# EAGLE design relay-monostable-multivib (EAGLE 9.6.2)
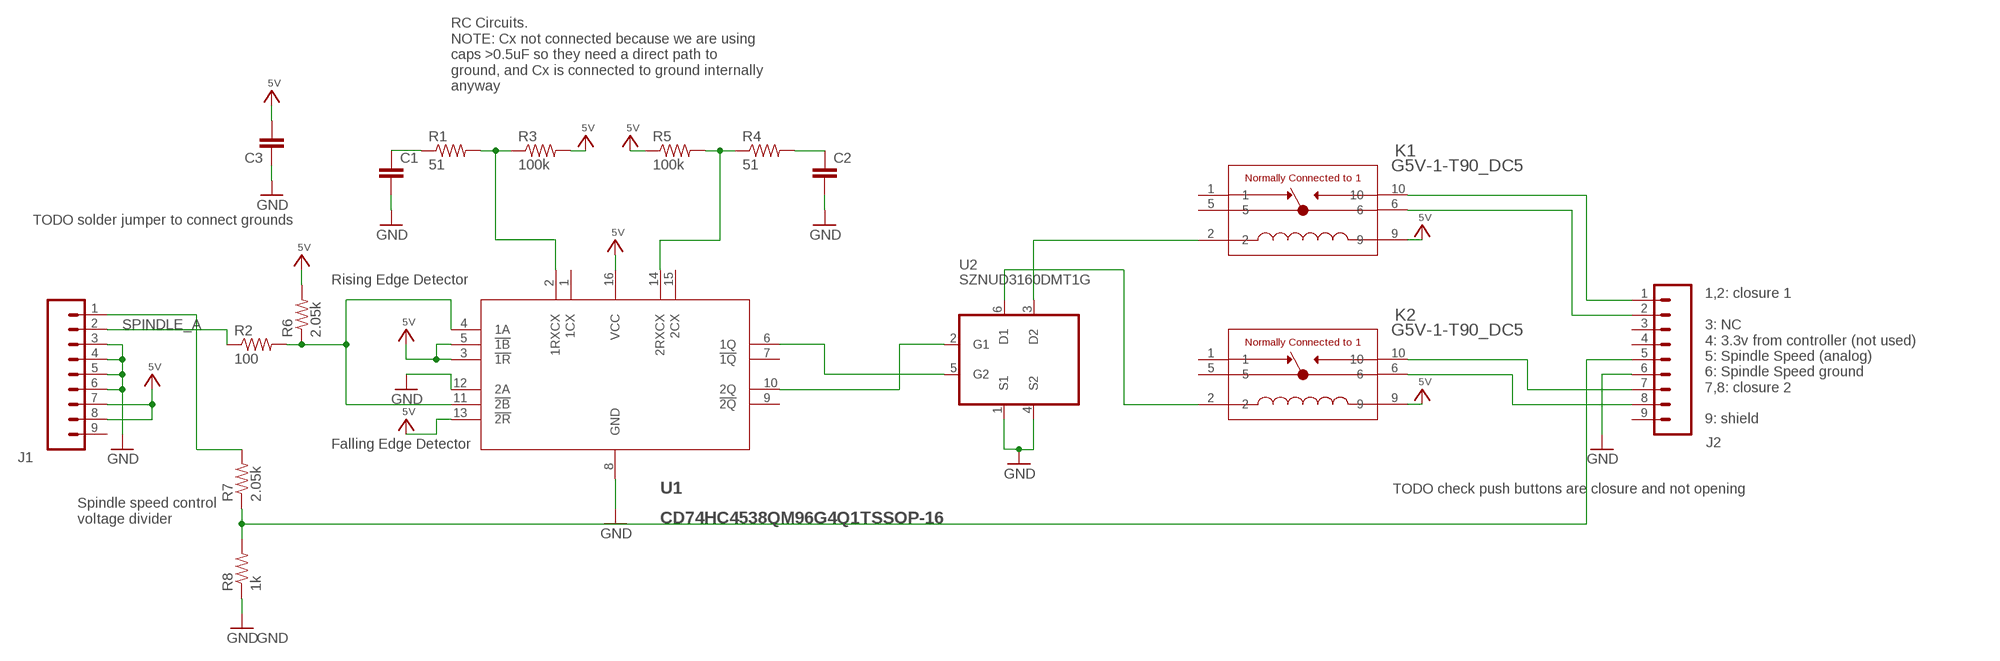
[diagram p0: schematic, sheet 1]

## Parts
C1  C-EU1206-A  [1206-A]
C2  C-EU1206-A  [1206-A]
C3  C-EU1206-A  [1206-A]
J1  CONN_09LONGPADS  [1X09_LONGPADS]
J2  CONN_09LONGPADS  [1X09_LONGPADS]
K1  G5V-1-T90_DC5  [RELAY_G5V-1_OMR]
K2  G5V-1-T90_DC5  [RELAY_G5V-1_OMR]
R1  51  R-US_1206-A  [1206-A]
R2  100  R-US_1206-A  [1206-A]
R3  100k  R-US_1206-A  [1206-A]
R4  51  R-US_1206-A  [1206-A]
R5  100k  R-US_1206-A  [1206-A]
R6  2.05k  R-US_1206-A  [1206-A]
R7  2.05k  R-US_1206-A  [1206-A]
R8  1k  R-US_1206-A  [1206-A]
U1  CD74HC4538QM96G4Q1TSSOP-16  [TSSOP16]
U2  SZNUD3160DMT1G  [SC74_6]

## Nets
5V [pwr]: C3.2 J1.7 J1.8 K1.9 K2.9 R3.2 R5.1 R6.2 U1.3(!1R) U1.5(!1B) U1.13(!2R) U1.16(VCC)
GND [pwr]: C1.2 C2.2 C3.1 J1.3 J1.4 J1.5 J1.6 J2.6 R8.1 U1.8(GND) U1.12(2A) U2.1(S1) U2.4(S2)
N$1 [pwr]: K2.2 U2.6(D1)
N$2: U1.6(1Q) U2.5(G2)
N$3: U1.10(2Q) U2.2(G1)
N$4: K1.2 U2.3(D2)
N$5: J2.5 R7.1 R8.2
N$6: R1.2 R3.1 U1.2(1RXCX)
N$7: C1.1 R1.1
N$8: R4.1 R5.2 U1.14(2RXCX)
N$9: C2.1 R4.2
N$10: R2.2 R6.1 U1.4(1A) U1.11(!2B)
N$11: J1.2 R2.1
N$12: J2.2 K1.6
N$13: J2.7 K2.10
N$14: J2.8 K2.6
N$15: J2.1 K1.10
SPINDLE_A: J1.1 R7.2
Unconnected: J1.9 J2.3 J2.4 J2.9 K1.1 K1.5 K2.1 K2.5 U1.1(1CX) U1.7(!1Q) U1.9(!2Q) U1.15(2CX)

## Notes on the sheet
- RC Circuits.
  NOTE: Cx not connected because we are using
  caps >0.5uF so they need a direct path to 
  ground, and Cx is connected to ground internally
  anyway
- TODO solder jumper to connect grounds
- Rising Edge Detector
- 1,2: closure 1
  
  3: NC
  4: 3.3v from controller (not used)
  5: Spindle Speed (analog)
  6: Spindle Speed ground
  7,8: closure 2
  
  9: shield
- Falling Edge Detector
- TODO check push buttons are closure and not opening
- Spindle speed control
  voltage divider

## Library data of the parts
C1-C3 = oresat-rcl:C-EU: CAPACITOR, European symbol
J1 J2 = SparkFun-Connectors:CONN_09: Multi connection point. Often used as Generic Header-pin footprint for 0.1 inch spaced/style header connections On any of the 0.1 inch spaced packages, you can populate with these: Break Away Headers - Straight <https://www.sparkfun.com/products/116> (PRT-00116) Break Away Male Headers - Right Angle <https://www.sparkfun.com/products/553> (PRT-00553) Female Headers <https://www.sparkfun.com/products/115> (PRT-00115) Break Away Headers - Machine Pin <https://www.sparkfun.com/products/117> (PRT-00117) Break Away Female Headers - Swiss Machine Pin <https://www.sparkfun.com/products/743> (PRT-00743) For SCREWTERMINALS and SPRING TERMINALS visit here: Screw Terimnals on SparkFun.com <https://www.sparkfun.com/search/results?term=Screw+Terminals> (5mm/3.5mm/2.54mm spacing) This device is also useful as a general connection point to wire up your design to another part of your project. Our various solder wires solder well into these plated through hole pads. Hook-Up Wire - Assortment (Stranded, 22 AWG) <https://www.sparkfun.com/products/11375> (PRT-11375) Hook-Up Wire - Assortment (Solid Core, 22 AWG) <https://www.sparkfun.com/products/11367> (PRT-11367) View the entire wire category on our website here <https://www.sparkfun.com/categories/141> Special notes: Molex polarized connector foot print use with SKU : PRT-08231 with associated crimp pins and housings. 1MM SMD Version SKU: PRT-10208 NOTES ON THE VARIANTS LOCK and LOCK_LONGPADS... This footprint was designed to help hold the alignment of a through-hole component (i.e. 6-pin header) while soldering it into place. You may notice that each hole has been shifted either up or down by 0.005 of an inch from it's more standard position (which is a perfectly straight line). This slight alteration caused the pins (the squares in the middle) to touch the edges of the holes. Because they are alternating, it causes a "brace" to hold the component in place. 0.005 has proven to be the perfect amount of "off-center" position when using our standard breakaway headers. Although looks a little odd when you look at the bare footprint, once you have a header in there, the alteration is very hard to notice. Also,if you push a header all the way into place, it is covered up entirely on the bottom side.
K1 K2 = K-Omron-G5V-1-T90-DC5:G5V-1-T90_DC5; BUILT_BY: EMA_Justin; COPYRIGHT: Copyright (C) 2018 Accelerated Designs. All rights reserved; MANUFACTURER_PART_NUMBER: G5V-1-T90 DC5; SOURCELIBRARY: Omron_2020-03-12; VENDOR: Omron
R1-R8 = oresat-rcl:R-US_: RESISTOR, American symbol
U1 = U-TI-CD74HC4538QM96G4Q1:CD74HC4538QM96G4Q1
U2 = U-ONsemi-SZNUD3160DMT1G:SZNUD3160DMT1G: LED Driver for High Power LEDs Source: http://www.infineon.com/dgdl/ILD4001-Step-down-LED-Controller-Rev2.0.pdf?folderId=db3a30431f848401011fcbf2ab4c04c4&fileId=db3a30433072cd8f01308fc1af03786b

## Net classes
0 default: width 0.254 mm, drill 0.35 mm, clearance 0.229 mm
1 pwr: width 0.406 mm, drill 0.35 mm, clearance 0.229 mm

## Board
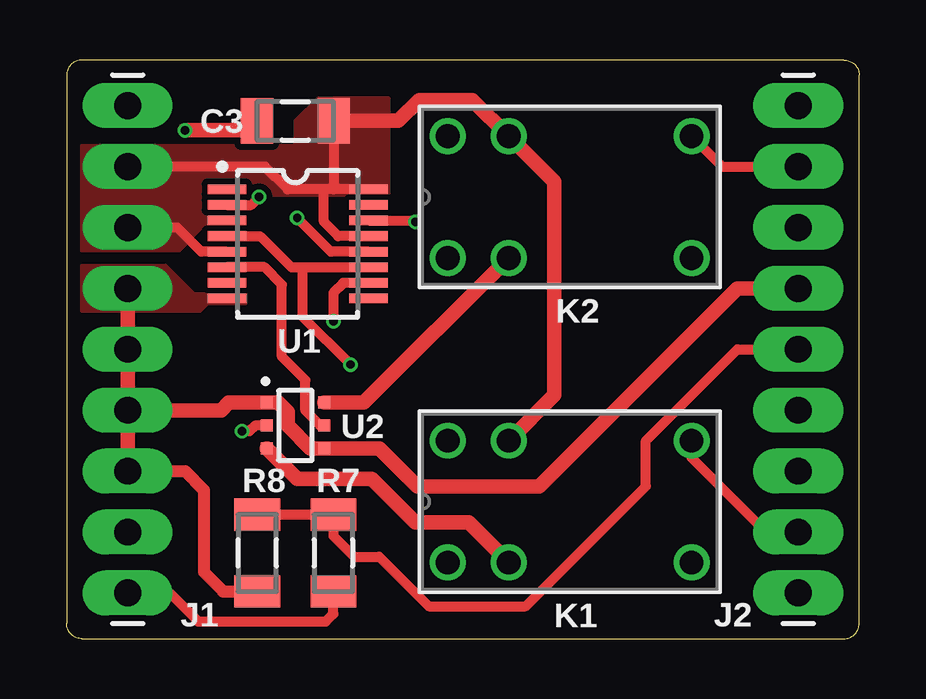
[diagram p1: board, top side]
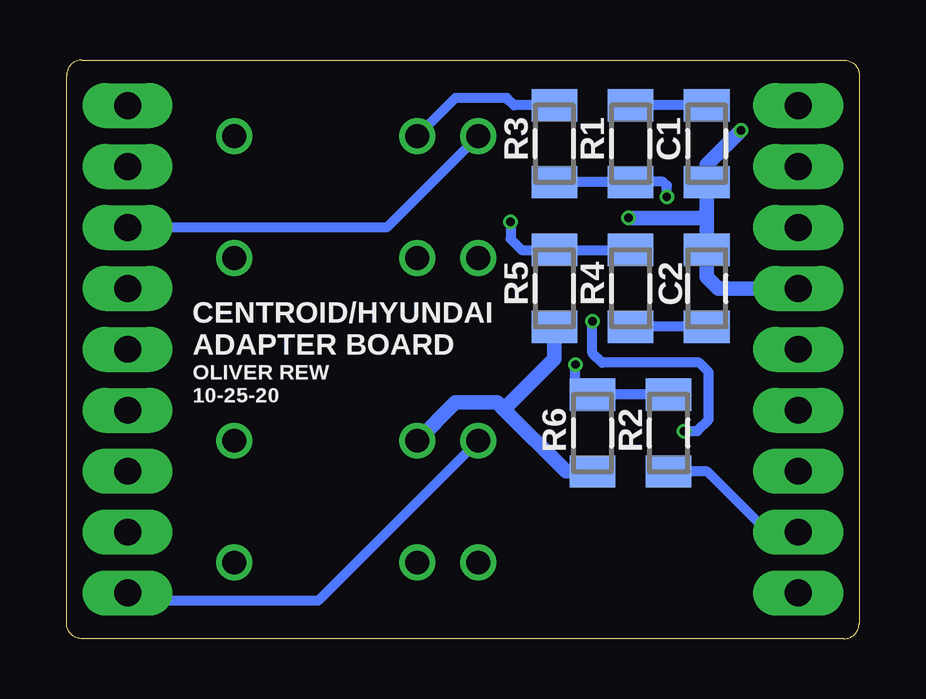
[diagram p2: board, bottom side, seen from below]

Size 33.02 x 24.13 mm. Coordinates in mm from the lower left corner, seen from the top.
Outline: 0.64,0 32.38,0 arc90 33.02,0.64 33.02,23.5 arc90 32.38,24.13 0.64,24.13 arc90 0,23.5 0,0.64 arc90 0.64,0
Copper layers (1*16): Top 0.035559375mm / dielectric 1.6mm / Bottom 0.035559375mm
Design rules "oshpark-2layer *": minimum track width 10mil, minimum drill 10mil, track to track 9mil, track to pad 9mil, pad to pad 9mil, via to via 9mil, smd to smd 9mil, copper to edge 15mil, drill to drill 9mil, minimum pad ring 5mil, minimum via ring 5mil, stop-mask expansion 2.5mil, vias tented up to drill 50mil, thermal gap 10mil

### Footprints (pad centres in the part's own frame; a part is rotated, then mirrored left to right if it is on the bottom)
1206-A = smd 1.35 x 1.9: 1 -1.6,0; 2 1.6,0
1X09_LONGPADS = drill 1.118 pad 1.88 long: 1 0,0; 2 2.54,0; 3 5.08,0; 4 7.62,0; 5 10.16,0; 6 12.7,0; 7 15.24,0; 8 17.78,0; 9 20.32,0
RELAY_G5V-1_OMR = drill 0.991 pad 1.499: 1 -5.08,10.16; 2 -5.08,7.62; 5 -5.08,0; 6 0,0; 9 0,7.62; 10 0,10.16
TSSOP16 = smd 0.4 x 1.6: 1 -2.225,-2.85; 2 -1.575,-2.85; 3 -0.925,-2.85; 4 -0.275,-2.85; 5 0.375,-2.85; 6 1.025,-2.85; 7 1.675,-2.85; 8 2.325,-2.85; 9 2.325,3.05; 10 1.675,3.05; 11 1.025,3.05; 12 0.375,3.05; 13 -0.275,3.05; 14 -0.925,3.05; 15 -1.575,3.05; 16 -2.225,3.05
SC74_6 = smd 0.5 x 0.5: 1 -0.95,-1.2; 2 0,-1.2; 3 0.95,-1.2; 4 0.95,1.2; 5 0,1.2; 6 -0.95,1.2

### Placement (x,y rotation side)
C1  6.35,20.64 270 bottom
C2  6.35,14.61 90 bottom
C3  9.53,21.59 0 top
J1  2.54,1.91 90 top
J2  30.48,1.91 90 top
K1  26.04,8.26 90 top
K2  26.04,20.95 90 top
R1  9.53,20.64 270 bottom
R2  7.94,8.57 90 bottom
R3  12.7,20.64 90 bottom
R4  9.53,14.61 270 bottom
R5  12.7,14.61 90 bottom
R6  11.11,8.57 270 bottom
R7  11.11,3.57 270 top
R8  7.94,3.57 90 top
U1  9.53,16.51 270 top
U2  9.53,8.89 270 top

### Tracks (layer width: path | path; a pad name or v marks a point on that pad's centre or on a via)
5V
  Top 0.406: U1.16 11.11,18.73 | 11.11,18.73 10.72,18.73 | 10.72,18.73 9.21,18.73 8.26,19.68 J1.8 | C3.2 11.12,18.75 11.11,18.73 | U1.13 11.31,16.79 10.72,17.38 10.72,18.73 | U1.5 5.61,16.14 4.6,17.14 J1.7
  Top 0.61: C3.2 13.81,21.59 14.68,22.46 16.91,22.46 K2.9 20.32,19.05 20.32,10.16 K1.9
  Bottom 0.406: R3.2 14.38,22.24 14.68,22.54 16.83,22.54 K2.9
  Bottom 0.61: R6.2 12.21,6.97 14.8,9.56 | K1.9 16.83,9.84 15.08,9.84 14.8,9.56 | R5.1 12.7,11.67 14.8,9.56
  pour Top (isolate 0.254, no thermals): 0.64,16.19 4.68,16.19 5.71,17.22 6.99,17.22 8.26,18.49 13.41,18.49 13.41,22.54 10.48,22.54 9.53,21.59 9.53,20.56 0.64,20.56
GND  (via drill 0.35)
  Top 0.406: U1.12 11.01,16.14 v9.6,17.54
  Top 0.508: J1.3 4.92,6.99 5.71,6.19 5.71,2.78 6.52,1.97 R8.1
  Top 0.61: J1.4 6.43,9.53 6.74,9.84 U2.1 8.81,9.84 9.21,9.45 9.21,8.89 10.16,7.94 U2.4 13.02,7.94 14.61,6.35 19.68,6.35 27.94,14.61 J2.6 | J1.6 J1.5 J1.4 | J1.3 J1.4 | C3.1 7.53,21.19 v4.92,21.19
  Bottom 0.61: v4.92,21.19 6.35,19.76 C1.2 6.35,17.78 | J1.6 5.87,14.61 6.35,15.08 C2.2 6.35,17.78 | 6.35,17.78 6.59,17.54 v9.6,17.54
  pour Top (no thermals): 0.64,15.56 4.13,15.56 5.32,14.37 7.46,14.37 7.46,13.97 5.87,13.97 5.56,13.65 0.64,13.65
N$1
  Top 0.61: K2.2 12.38,9.84 U2.6
N$2
  Top 0.406: U2.5 10.56,8.89 9.94,9.51 9.94,10.78 8.97,11.76 8.97,14.76 8.25,15.48 U1.6
N$3  (via drill 0.35)
  Top 0.406: U2.2 7.85,8.89 7.61,8.65 v7.3,8.65 | U1.10 11.52,14.84 11.11,14.43 v11.11,13.24
  Bottom 0.406: v11.11,13.24 11.11,11.91 10.72,11.51 6.67,11.51 6.27,11.11 6.27,9.13 6.75,8.65 v7.3,8.65
N$4
  Top 0.61: K1.2 16.75,4.84 14.53,4.84 12.7,6.67 9.6,6.67 U2.3
N$5
  Top 0.406: R8.2 R7.1 11.11,4.29 11.99,3.41 13.02,3.41 15.08,1.35 19.13,1.35 24.13,6.35 24.13,8.26 27.94,12.06 J2.5
N$6  (via drill 0.35)
  Top 0.406: U1.2 7.69,18.09 v8.02,18.41
  Bottom 0.406: R3.1 R1.2 9.51,19.05 8.18,19.05 8.02,18.89 v8.02,18.41
N$7
  Bottom 0.406: C1.1 R1.1
N$8  (via drill 0.35)
  Top 0.406: U1.14 14.47,17.43 v14.53,17.38
  Bottom 0.406: R4.1 R5.2 14.06,16.2 14.53,16.67 v14.53,17.38
N$9
  Bottom 0.406: C2.1 R4.2
N$10  (via drill 0.35)
  Top 0.406: U1.4 8.06,16.79 9.36,15.48 9.84,15.48 | 9.84,15.48 U1.11 | v11.83,11.43 9.84,13.41 9.84,15.48
  Bottom 0.406: R2.2 R6.1 11.27,10.17 11.83,10.73 v11.83,11.43
N$11
  Bottom 0.406: J1.2 3.81,4.45 6.34,6.97 R2.1
N$12
  Top 0.406: K1.6 26.04,7.54 29.13,4.45 J2.2
N$13
  Bottom 0.406: K2.10 19.68,17.14 J2.7
N$14
  Top 0.406: K2.6 27.3,19.68 J2.8
N$15
  Bottom 0.406: K1.10 22.54,1.59 30.16,1.59 J2.1
SPINDLE_A
  Top 0.406: J1.1 4.29,1.91 5.48,0.71 10.79,0.71 11.11,1.03 R7.2

### Text on the board
bPlace: CENTROID/HYUNDAI / ADAPTER BOARD | OLIVER REW / 10-25-20